# Altium schematic sheet Carte_Servo_Robot_2.SchDoc
size A
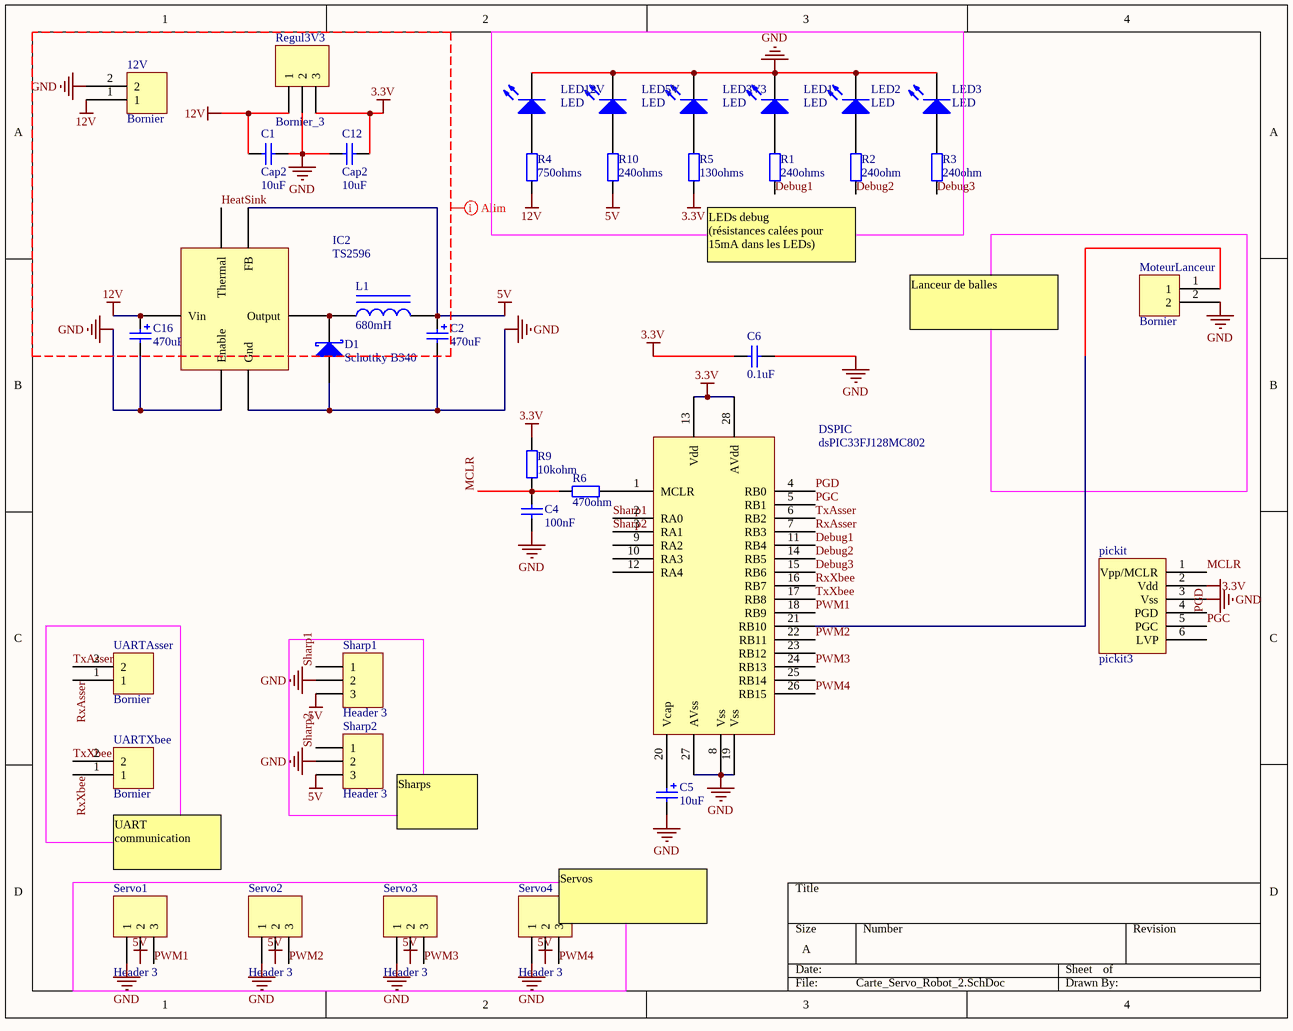
[diagram p0: Carte_Servo_Robot_2.SchDoc]

## Parts
12V  Bornier  [Bornier]
C1  Cap2  value 10uF  [CAPA2]
C2  470uF  [Capa_pol1]
C4  100nF  [Capa_plastique]
C5  10uF  [Capa_pol1]
C6  0.1uF  [Capa_plastique]
C12  Cap2  value 10uF  [CAPA2]
C16  470uF  [Capa_pol1]
D1  Schottky B340  [SMC]
DSPIC  dsPIC33FJ128MC802  [DIP28]
IC2  TS2596  [TO263-5L]
L1  Valeur: 680mH  [self]  (hidden comment: Inductance)
LED1  LED  [Led_5mm]
LED2  LED  [Led_5mm]
LED3  LED  [Led_5mm]
LED3V3  LED  [Led_5mm]
LED5V  LED  [Led_5mm]
LED12V  LED  [Led_5mm]
MoteurLanceur  Bornier  [Bornier]
pickit  pickit3  [pickit3]
R1  240ohms  [traversant 1/4W]
R2  240ohm  [traversant 1/4W]
R3  240ohm  [traversant 1/4W]
R4  750ohms  [traversant 1/4W]
R5  130ohms  [traversant 1/4W]
R6  470ohm  [traversant 1/4W]
R9  10kohm  [traversant 1/4W]
R10  240ohms  [traversant 1/4W]
Regul3V3  Bornier_3  [Bornier_3]
Servo1  Header 3  [HDR1X3]
Servo2  Header 3  [HDR1X3]
Servo3  Header 3  [HDR1X3]
Servo4  Header 3  [HDR1X3]
Sharp1  Header 3  [HDR1X3]
Sharp2  Header 3  [HDR1X3]
UARTAsser  Bornier  [Bornier]
UARTXbee  Bornier  [Bornier]

## Nets
3.3V: C6.1 C12.2 DSPIC.13(Vdd) DSPIC.28(AVdd) pickit.2(Vdd) R5.1 R9.1 Regul3V3.3
5V: C2.1 IC2.4(FB) L1.2 R10.1 Servo1.2 Servo2.2 Servo3.2 Servo4.2 Sharp1.3 Sharp2.3
12V: 12V.1 C1.1 C16.1 IC2.1(Vin) R4.1 Regul3V3.1
GND: 12V.2 C1.2 C2.2 C4.1 C5.2 C6.2 C12.1 C16.2 D1.1(A) DSPIC.8(Vss) DSPIC.19(Vss) DSPIC.27(AVss) IC2.3(Gnd) IC2.5(Enable) LED1.2(K) LED2.2(K) LED3.2(K) LED3V3.2(K) LED5V.2(K) LED12V.2(K) MoteurLanceur.2 pickit.3(Vss) Regul3V3.2 Servo1.1 Servo2.1 Servo3.1 Servo4.1 Sharp1.2 Sharp2.2
Debug1: DSPIC.11(RB4) R1.1
Debug2: DSPIC.14(RB5) R2.1
Debug3: DSPIC.15(RB6) R3.1
HeatSink: IC2.0(Thermal)
MCLR: C4.2 pickit.1(Vpp/MCLR) R6.2 R9.2
PGC: DSPIC.5(RB1) pickit.5(PGC)
PGD: DSPIC.4(RB0) pickit.4(PGD)
PWM1: DSPIC.18(RB9) Servo1.3
PWM2: DSPIC.22(RB11) Servo2.3
PWM3: DSPIC.24(RB13) Servo3.3
PWM4: DSPIC.26(RB15) Servo4.3
RxAsser: DSPIC.7(RB3) UARTAsser.1
RxXbee: DSPIC.16(RB7) UARTXbee.1
Sharp1: DSPIC.2(RA0) Sharp1.1
Sharp2: DSPIC.3(RA1) Sharp2.1
TxAsser: DSPIC.6(RB2) UARTAsser.2
TxXbee: DSPIC.17(RB8) UARTXbee.2
NetC5_1: C5.1 DSPIC.20(Vcap)
NetD1_2: D1.2(K) IC2.2(Output) L1.1
NetDSPIC_1: DSPIC.1(MCLR) R6.1
NetDSPIC_21: DSPIC.21(RB10) MoteurLanceur.1
NetLED1_1: LED1.1(A) R1.2
NetLED2_1: LED2.1(A) R2.2
NetLED3_1: LED3.1(A) R3.2
NetLED3V3_1: LED3V3.1(A) R5.2
NetLED5V_1: LED5V.1(A) R10.2
NetLED12V_1: LED12V.1(A) R4.2

Not connected (* = marked no-connect by the designer): DSPIC 9(RA2) 10(RA3) 12(RA4) 23(RB12) 25(RB14); pickit 6(LVP)

## Layout directives
net class Undefined: 3.3V, 12V, GND, HeatSink

## Notes on the sheet
- LEDs debug
  (résistances calées pour 15mA dans les LEDs)
- Lanceur de balles
- Sharps
- (near UARTXbee) UART communication
- (near Servo4) Servos

## Library data of the parts
12V MoteurLanceur UARTAsser UARTXbee = Bornier2
C1 C12 = Cap2: Capacitor; Published: 8-Jun-2000; LatestRevisionDate: 17-Jul-2002; LatestRevisionNote: Re-released for DXP Platform.; PackageReference: RAD-0.3; Publisher: Altium Limited
C2 C5 C16 = Capa Pol
C4 C6 = Capa
R1-R6 R9 R10 = Resistance
Regul3V3 = Bornier_3: Header, 3-Pin; LatestRevisionDate: 17-Jul-2002; LatestRevisionNote: Re-released for DXP Platform.; Publisher: Altium Limited
Servo1-Servo4 Sharp1 Sharp2 = Header 3: Header, 3-Pin; LatestRevisionDate: 17-Jul-2002; LatestRevisionNote: Re-released for DXP Platform.; Publisher: Altium Limited